# Altium schematic sheet 14_LCD_TS_CT.SchDoc: =TitleParameter
size A3; Address: Crete IL; Organization: ASISGUARD; Address1: Kemalpasa, Kemalpasa Cd. No:290 D:292H, 35060 Bornova/Izmir/Turkey
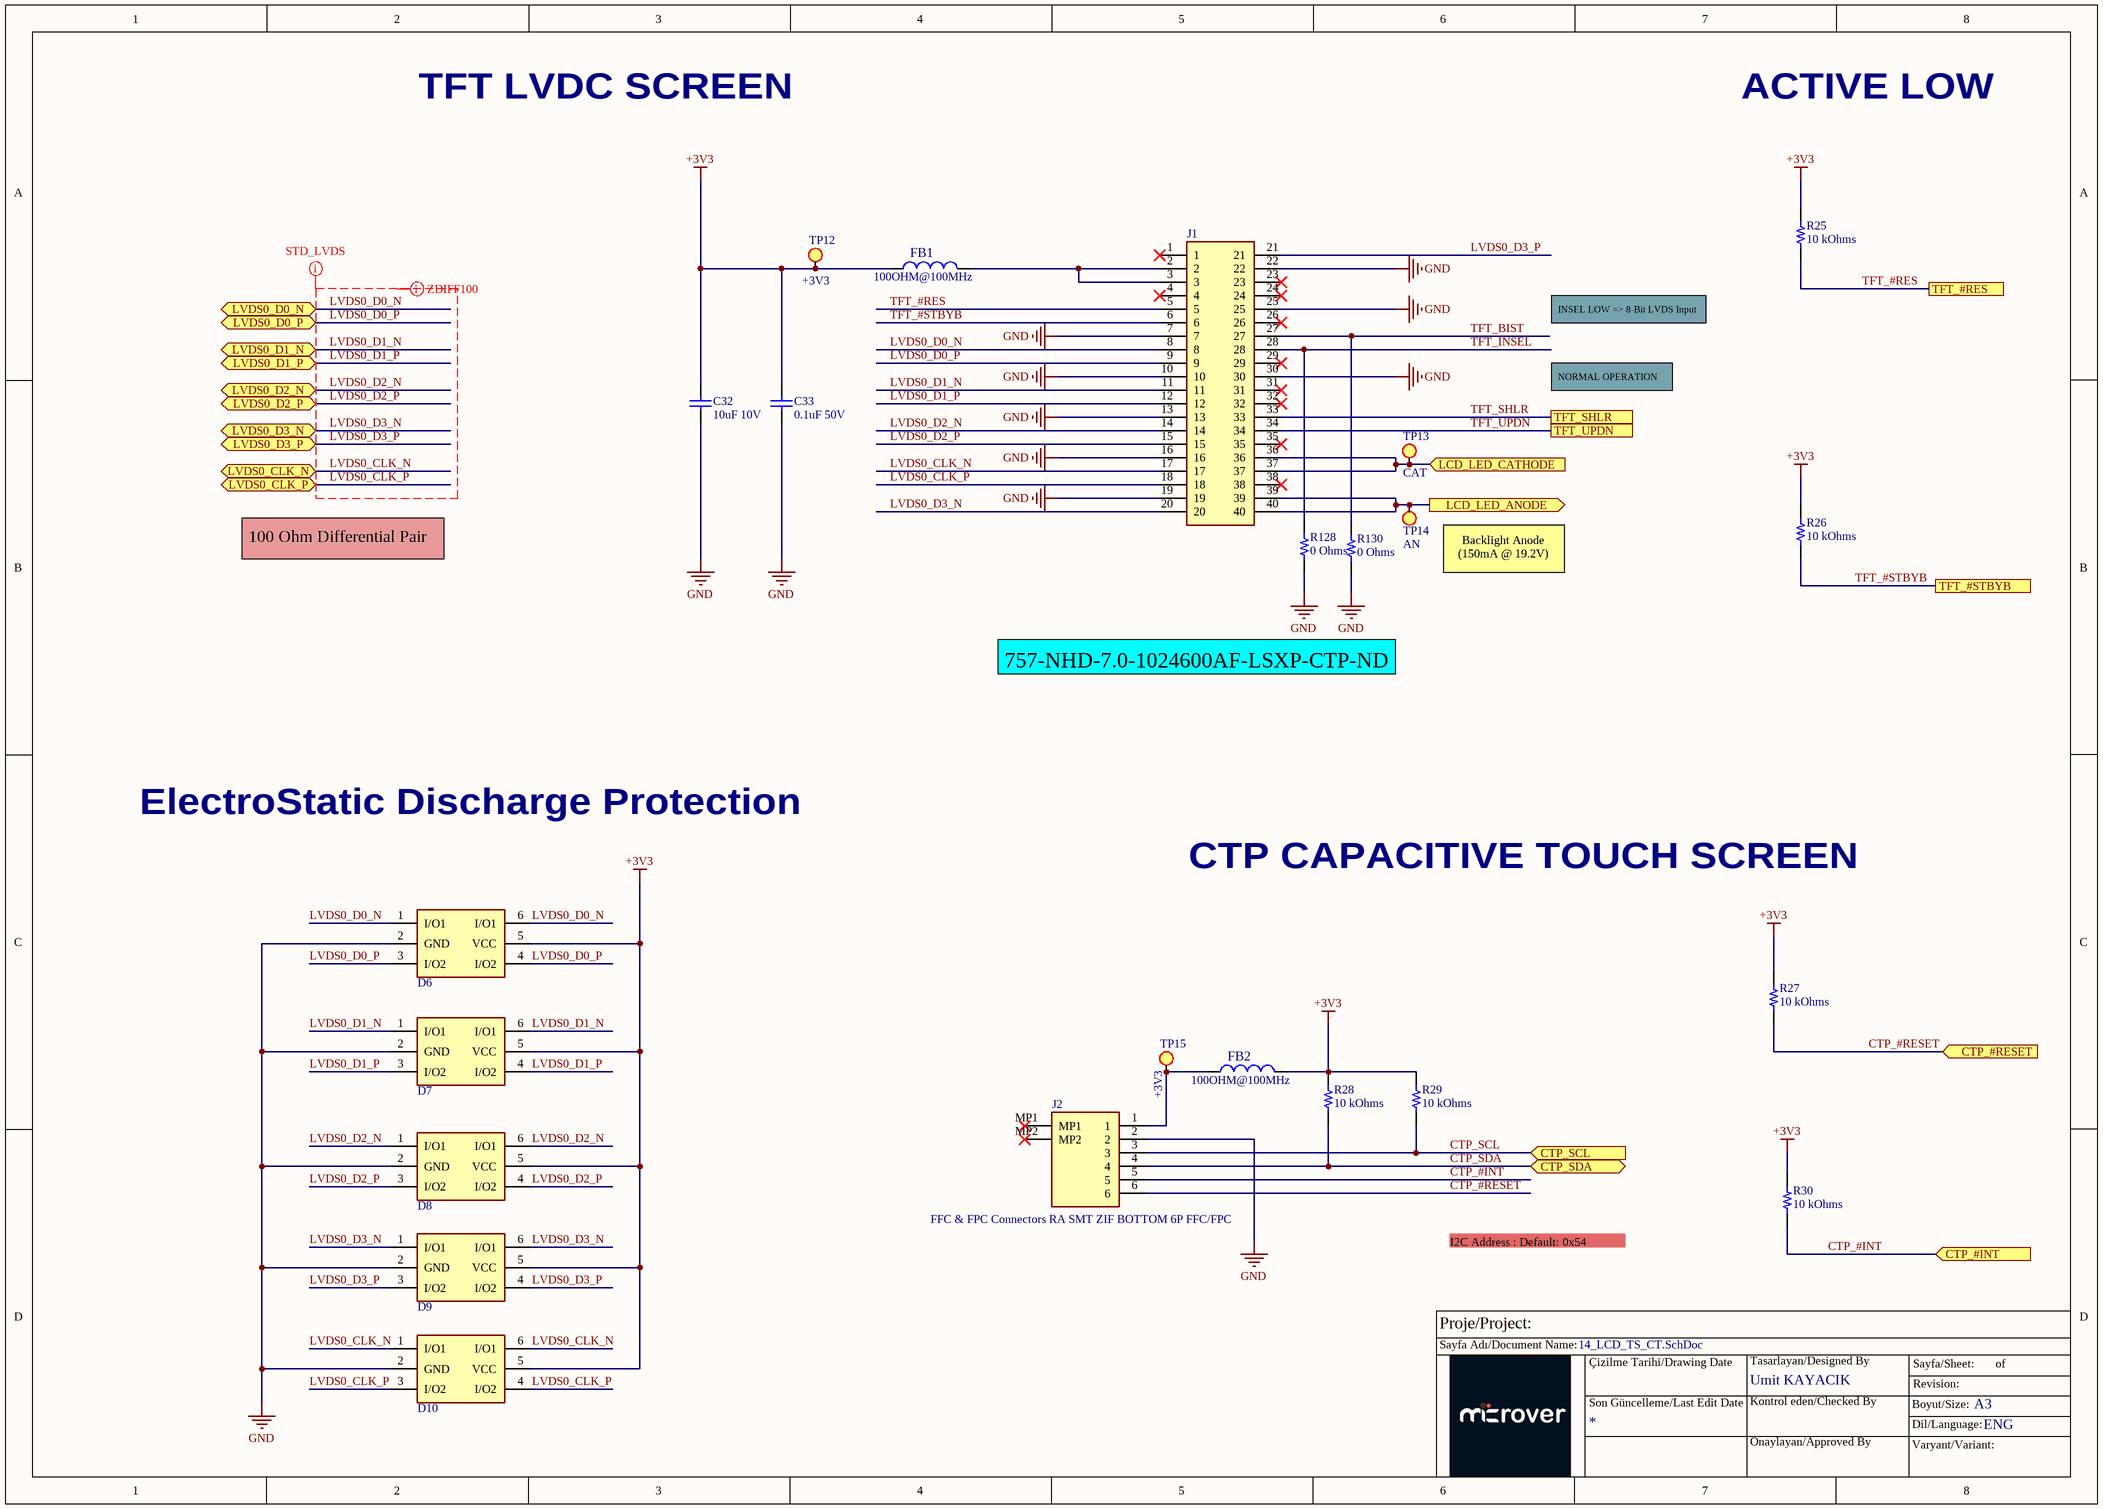
[diagram p0: 14_LCD_TS_CT.SchDoc]

## Parts
C32  value 10uF 10V  [SMC1206]  (hidden comment: CAP CER 10UF 10V X7R 1206)
C33  value 0.1uF 50V  [SMC0603]  (hidden comment: CAP CER 0.1UF 50V X7R 0603)
D6  SON-6(1x1.5) ESD Protection Devices ROHS  [Nexperia_SOT886_MFG]  (value not drawn)
D7  SON-6(1x1.5) ESD Protection Devices ROHS  [Nexperia_SOT886_MFG]  (value not drawn)
D8  SON-6(1x1.5) ESD Protection Devices ROHS  [Nexperia_SOT886_MFG]  (value not drawn)
D9  SON-6(1x1.5) ESD Protection Devices ROHS  [Nexperia_SOT886_MFG]  (value not drawn)
D10  SON-6(1x1.5) ESD Protection Devices ROHS  [Nexperia_SOT886_MFG]  (value not drawn)
FB1  100OHM@100MHz  [FB 0603(1608)]
FB2  100OHM@100MHz  [FB 0603(1608)]
J1  FFC & FPC Connectors 0.5 FPC ZIF SMT R/AU prCont40CktEmbsTpPk  [54104-4031]  (value not drawn)
J2  FFC & FPC Connectors RA SMT ZIF BOTTOM 6P FFC/FPC  [522710679]
R25  10 kOhms  [RES 0402_1005]
R26  10 kOhms  [RES 0402_1005]
R27  10 kOhms  [RES 0402_1005]
R28  10 kOhms  [RES 0402_1005]
R29  10 kOhms  [RES 0402_1005]
R30  10 kOhms  [RES 0402_1005]
R128  0 Ohms  [RES0402(1005)]
R130  0 Ohms  [RES0402(1005)]
TP12  +3V3  [TEST_POINT]
TP13  CAT  [TEST_POINT]
TP14  AN  [TEST_POINT]
TP15  +3V3  [TEST_POINT]

## Ports
CTP_#INT (in), CTP_#RESET (in), CTP_SCL (in), CTP_SDA (bidir), LCD_LED_ANODE (out), LCD_LED_CATHODE (in), LVDS0_CLK_N (bidir), LVDS0_CLK_P (bidir), LVDS0_D0_N (bidir), LVDS0_D0_P (bidir), LVDS0_D1_N (bidir), LVDS0_D1_P (bidir), LVDS0_D2_N (bidir), LVDS0_D2_P (bidir), LVDS0_D3_N (bidir), LVDS0_D3_P (bidir), TFT_#RES, TFT_#STBYB, TFT_SHLR, TFT_UPDN

## Nets
+3V3: C32.2 C33.2 D6.5(VCC) D7.5(VCC) D8.5(VCC) D9.5(VCC) D10.5(VCC) FB1.2 FB2.1 R25.2 R26.2 R27.2 R28.2 R29.2 R30.2 TP12.1(TP)
GND: C32.1 C33.1 D6.2(GND) D7.2(GND) D8.2(GND) D9.2(GND) D10.2(GND) J1.7 J1.10 J1.13 J1.16 J1.19 J1.22 J1.25 J1.30 J2.2 R128.2 R130.2
CTP_#INT: J2.5 R30.1 ; port CTP_#INT
CTP_#RESET: J2.6 R27.1 ; port CTP_#RESET
CTP_SCL: J2.3 R29.1 ; port CTP_SCL
CTP_SDA: J2.4 R28.1 ; port CTP_SDA
LCD_LED_ANODE: J1.39 J1.40 TP14.1(TP) ; port LCD_LED_ANODE
LCD_LED_CATHODE: J1.36 J1.37 TP13.1(TP) ; port LCD_LED_CATHODE
LVDS0_CLK_N: D10.1(I/O1) D10.6(I/O1) J1.17 ; port LVDS0_CLK_N
LVDS0_CLK_P: D10.3(I/O2) D10.4(I/O2) J1.18 ; port LVDS0_CLK_P
LVDS0_D0_N: D6.1(I/O1) D6.6(I/O1) J1.8 ; port LVDS0_D0_N
LVDS0_D0_P: D6.3(I/O2) D6.4(I/O2) J1.9 ; port LVDS0_D0_P
LVDS0_D1_N: D7.1(I/O1) D7.6(I/O1) J1.11 ; port LVDS0_D1_N
LVDS0_D1_P: D7.3(I/O2) D7.4(I/O2) J1.12 ; port LVDS0_D1_P
LVDS0_D2_N: D8.1(I/O1) D8.6(I/O1) J1.14 ; port LVDS0_D2_N
LVDS0_D2_P: D8.3(I/O2) D8.4(I/O2) J1.15 ; port LVDS0_D2_P
LVDS0_D3_N: D9.1(I/O1) D9.6(I/O1) J1.20 ; port LVDS0_D3_N
LVDS0_D3_P: D9.3(I/O2) D9.4(I/O2) J1.21 ; port LVDS0_D3_P
TFT_#RES: J1.5 R25.1 ; port TFT_#RES
TFT_#STBYB: J1.6 R26.1 ; port TFT_#STBYB
TFT_BIST: J1.27 R130.1
TFT_INSEL: J1.28 R128.1
TFT_SHLR: J1.33 ; port TFT_SHLR
TFT_UPDN: J1.34 ; port TFT_UPDN
NetFB1_1: FB1.1 J1.2 J1.3
NetFB2_2: FB2.2 J2.1 TP15.1(TP)

Not connected (* = marked no-connect by the designer): J1 1* 4* 23* 24* 26* 29* 31* 32* 35* 38*; J2 MP1* MP2*

## Layout directives
net class STD_LVDS: LVDS0_CLK_N, LVDS0_CLK_P, LVDS0_D0_N, LVDS0_D0_P, LVDS0_D1_N, LVDS0_D1_P, LVDS0_D2_N, LVDS0_D2_P, LVDS0_D3_N, LVDS0_D3_P
differential pair; differential pair class ZDIFF100: LVDS0_CLK_N, LVDS0_CLK_P, LVDS0_D0_N, LVDS0_D0_P, LVDS0_D1_N, LVDS0_D1_P, LVDS0_D2_N, LVDS0_D2_P, LVDS0_D3_N, LVDS0_D3_P

## Notes on the sheet
- TFT LVDC SCREEN
- ACTIVE LOW
- INSEL LOW => 8-Bit LVDS Input
- NORMAL OPERATION
- 100 Ohm Differential Pair
- (near TP14) Backlight Anode (150mA @ 19.2V)
- 757-NHD-7.0-1024600AF-LSXP-CTP-ND
- ElectroStatic Discharge Protection
- CTP CAPACITIVE TOUCH SCREEN
- I2C Address : Default: 0x54
- Proje/Project:
- Sayfa Adı/Document Name:
- Çizilme Tarihi/Drawing Date
- Umit KAYACIK
- Tasarlayan/Designed By
- Sayfa/Sheet:
- Revision:
- of
- Son Güncelleme/Last Edit Date
- Kontrol eden/Checked By
- Onaylayan/Approved By
- Boyut/Size:
- Varyant/Variant:
- Dil/Language:
- A3
- ENG

## Library data of the parts
C32 = CAP1206_10UF_10V: 10 µF ±10% 10V Ceramic Capacitor X7R 1206 (3216 Metric); Manufacturer Part Number: CL31B106KPHNNNE; Order Code: Digi: 1276-1311-2-ND; Sirius Stock Code: *; LCSC Part Number: C96449; LCSC Manufacturer Part Number: CL31B106KPHNNNE
C33 = CAP0603_0.1UF_50V: 0.1 µF ±10% 50V Ceramic Capacitor X7R 0603 (1608 Metric); Manufacturer Part Number: CL10B104KB8NNNL; LCSC Manufacturer Part Number: CL10B104KB8NNNC; Order Code: DIGI:1276-CL10B104KB8NNNLTR-ND; Sirius Stock Code: A063-AGC10300001226; LCSC Part Number: C1591
D6-D10 = PRTR5V0U2F: Order Code: LCSC: C2937001; Manufacturer Part Number: PRTR5V0U2F; LCSC Manufacturer Part Number: PRTR5V0U2F; LCSC Part Number: C2937001
FB1 FB2 = FB0603_100OHM_100MHz: 100 Ohms @ 100 MHz 1 Power Line Ferrite Bead 0603 (1608 Metric) 2A 40mOhm; Manufacturer: TDK; Manufacturer Part Number: MPZ1608Y101BTA00; Tolerance: 25%; Impedance: 100R; DC Resistance (DCR): 40mR; ComponentLink1URL: https://chn-vm-apps.microchip.com/mchprepo/parts/Datasheets/beads_commercial_power_mpz_en.pdf; ComponentLink1Description: Datasheet; Supplier 1: Digi-Key; Supplier Part Number 1: 445-2984-1-ND; RoHS: Yes; Category: Ferrite Beads and Chips; Stock 1: 551; Pricing 1: 1=0,10000, 10=0,07200, 25=0,06480, 50=0,05840, 100=0,04290, 250=0,03120, 500=0,02860, 1000=0,02470 (USD); Mount: Surface Mount; Case/Package: 0603; Case Code (Metric): 1608; Case Code (Imperial): 0603; Core Material: Ferrite; Packaging: Tape and Reel; Package Quantity: 4000; Max DC Current: 2A; Current Rating: 2A; Series: MPZ; Length: 0.063inch; Width: 0.031inch; Height: 0.037inch; RoHS Compliant: Yes; REACH SVHC: No SVHC; ComponentLink2URL: https://datasheet.ciiva.com/46634/beads-commercial-power-mpz-en-46634677.pdf?src-supplier=Digi-Key; ComponentLink2Description: https://datasheet.ciiva.com/46634/beads-commercial-power-mpz-en-46634677.pdf?src-supplier=Digi-Key; ComponentLink3URL: https://datasheet.ciiva.com/48682/beads-commercial-power-mpz-en-48682501.pdf?src-supplier=Avnet; ComponentLink3Description: https://datasheet.ciiva.com/48682/beads-commercial-power-mpz-en-48682501.pdf?src-supplier=Avnet; ComponentLink4URL: https://datasheet.ciiva.com/46634/beads-commercial-power-mpz-en-46634684.pdf?src-supplier=Digi-Key; ComponentLink4Description: https://datasheet.ciiva.com/46634/beads-commercial-power-mpz-en-46634684.pdf?src-supplier=Digi-Key; ComponentLink5URL: https://datasheet.ciiva.com/46634/beads-commercial-power-mpz-en-46634621.pdf?src-supplier=Digi-Key; ComponentLink5Description: https://datasheet.ciiva.com/46634/beads-commercial-power-mpz-en-46634621.pdf?src-supplier=Digi-Key; Parameter 1: *; LCSC Manufacturer Part Number: MPZ1608Y101BTA00; LCSC Part Number: C501996
J1 = 54104-4031: Conn FFC/FPC Connector SKT 40 POS 0.5mm Solder RA SMD Easy-On™ T/R; Manufacturer: Molex; Actuator Material: Glass,Polyphenylene; Actuator Color: Brown; Plating: 157ConductorMaterial; Number of Contacts: 40; Voltage Rating: 50V; Contact Resistance: 20mR; Current Rating: 500mA; Wire/Cable Type: Straight; Mating Cycles: 20; Contact Location: Top; Gender: Receptacle; Number of Circuits: 40NUMBER; Stackable: 5898YesNo; Supplier 1: Mouser; Manufacturer Part Number: 54104-4031; RoHS: Yes; Category: FFC / FPC; Stock 1: 10870; Pricing 1: 1=3,22, 10=2,84, 50=2,84, 100=2,03, 1000=2,03, 10000=1,76 (USD); Mount: Surface Mount; Contact Material: Bronze; Contact Plating: Unplated,Gold; Housing Color: Natural; Housing Material: Nylon; Material: 150ConductorMaterial; Min Operating Temperature: -20°C; Max Operating Temperature: 85°C; Number of Rows: 1; Termination: Solder; Orientation: Right Angle; Packaging: Tape and Reel; Package Quantity: 1500; Number of Positions: 40; Series: 54104; Length: 25.5mm; Pitch: 0.5mm; Depth: 5.6mm; Radiation Hardening: No; Flammability Rating: UL94 V-0; RoHS Compliant: Yes; Reach SVHC Compliant: Unknown; ELV: 5681ELVCompliant; Supplier Part Number 1: 538-54104-4031
J2 = 52271-0679: FFC/FPC SMT SER 1mm Pitch 6Way RightAngle SMT Female FPC Conn; ZIF Bottom Contact; Manufacturer: Molex; Supplier 1: Mouser; Manufacturer Part Number: 52271-0679; RoHS: Yes; Category: FFC / FPC; Stock 1: 7632; Pricing 1: 1=1,1, 10=0,906, 50=0,906, 100=0,755, 1000=0,604, 10000=0,491 (USD); ComponentLink1URL: https://datasheet.ciiva.com/27051/1301235-27051913.pdf?src-supplier=Jameco; ComponentLink1Description: https://datasheet.ciiva.com/27051/1301235-27051913.pdf?src-supplier=Jameco; ComponentLink2URL: https://datasheet.ciiva.com/5136/0522710679-ffc-fpc-connectors-149405-5136769.pdf?src-supplier=Mouser; ComponentLink2Description: https://datasheet.ciiva.com/5136/0522710679-ffc-fpc-connectors-149405-5136769.pdf?src-supplier=Mouser; ComponentLink3URL: https://datasheet.ciiva.com/30226/212340522710679-ffc-fpc-nectors-30226867.pdf?src-supplier=Onlinecomponents.com; ComponentLink3Description: https://datasheet.ciiva.com/30226/212340522710679-ffc-fpc-nectors-30226867.pdf?src-supplier=Onlinecomponents.com; ComponentLink4URL: https://datasheet.ciiva.com/10034/0522710679-ffc-fpc-connectors-10034899.pdf?src-supplier=Avnet; ComponentLink4Description: https://datasheet.ciiva.com/10034/0522710679-ffc-fpc-connectors-10034899.pdf?src-supplier=Avnet; ComponentLink5URL: https://datasheet.ciiva.com/16123/203510522710679-ffc-fpc-nectors-16123334.pdf?src-supplier=Onlinecomponents.com; ComponentLink5Description: https://datasheet.ciiva.com/16123/203510522710679-ffc-fpc-nectors-16123334.pdf?src-supplier=Onlinecomponents.com; ComponentLink6URL: https://datasheet.ciiva.com/8038/704159-8038352.pdf?src-supplier=Element14; ComponentLink6Description: https://datasheet.ciiva.com/8038/704159-8038352.pdf?src-supplier=Element14; ComponentLink7URL: https://datasheet.ciiva.com/11745/0900766b8078fc42-11745220.pdf?src-supplier=Rs; ComponentLink7Description: https://datasheet.ciiva.com/11745/0900766b8078fc42-11745220.pdf?src-supplier=Rs; ComponentLink8URL: https://datasheet.ciiva.com/14483/704159-14483351.pdf?src-supplier=Farnell; ComponentLink8Description: https://datasheet.ciiva.com/14483/704159-14483351.pdf?src-supplier=Farnell; Supplier Part Number 1: 538-52271-0679
R25-R30 = RP73PF1E10KBTD: RES 10K OHM 0.1% 1/10W 0402; Manufacturer: TE Connectivity Passive Product; Power (Watts): 0.1W, 1/10W; Temperature Coefficient: ±25ppm/°C; Part Number: RP73PF1E10KBTD; Value: 10 kOhms; ComponentLink1Description: Datasheet; ComponentLink1URL: https://www.te.com/commerce/DocumentDelivery/DDEController?Action=srchrtrv&DocNm=1773272&DocType=DS&DocLang=English; ComponentLink2Description: DigiKey Link; ComponentLink2URL: https://www.digikey.com/en/products/detail/te-connectivity-passive-product/RP73PF1E10KBTD/8260957; Composition: Thin Film; Device Package: 0402 (1005 Metric); Height - Seated (Max): 0.014" (0.35mm); LastUpdated: 2/9/2024 8:30:24 PM; Lifecycle Status: Active; Minimum Order: 1; Number of Terminations: 2; Operating Temperature: -55°C ~ 155°C; Package / Case: 0402 (1005 Metric); Packaging: TapeAndReel; PartId: 2434; Part Status: Active; Price: 0.08; Resistance: 10 kOhms; Series: RP73, Holsworthy; Size / Dimension: 0.039" L x 0.020" W (1.00mm x 0.50mm); Supplier 1: DigiKey; Supplier Part Number 1: A127415CT-ND; Supplier Device Package: 0402; Tolerance: ±0.1%
R128 R130 = HCJ0402ZT0R00: RES 0 OHM JUMPER 1/8W 0402; Manufacturer: Stackpole Electronics Inc; Power (Watts): 0.125W, 1/8W; Part Number: HCJ0402ZT0R00; Value: 0 Ohms; ComponentLink1Description: Datasheet; ComponentLink1URL: https://www.seielect.com/catalog/sei-hcj.pdf; ComponentLink2Description: DigiKey Link; ComponentLink2URL: https://www.digikey.com/en/products/detail/stackpole-electronics-inc/HCJ0402ZT0R00/4357659; Composition: Metal Foil; Device Package: 0402 (1005 Metric); Features: Automotive AEC-Q200; Height - Seated (Max): 0.018" (0.45mm); LastUpdated: 2/9/2024 8:29:49 PM; Lifecycle Status: Active; Minimum Order: 1; Number of Terminations: 2; Operating Temperature: -55°C ~ 155°C; Package / Case: 0402 (1005 Metric); Packaging: TapeAndReel; PartId: 12327; Part Status: Active; Price: 0.07; Ratings: AEC-Q200; Resistance: 0 Ohms; Series: HCJ; Size / Dimension: 0.039" L x 0.020" W (1.00mm x 0.50mm); Supplier 1: DigiKey; Supplier Part Number 1: HCJ0402ZT0R00CT-ND; Supplier Device Package: 0402; Tolerance: Jumper
TP12-TP15 = TP_1